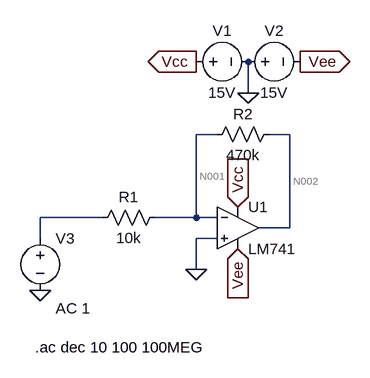
[diagram p0: schematic inverting_amp.asc]
inverting_amp.asc, the LTspice schematic file:
Version 4.1
SHEET 1 880 680
WIRE 208 -48 208 -96
WIRE 160 16 128 16
WIRE 272 16 240 16
WIRE -16 144 -112 144
WIRE 128 144 128 16
WIRE 128 144 64 144
WIRE 160 144 128 144
WIRE 272 160 272 16
WIRE 272 160 224 160
WIRE -112 176 -112 144
WIRE 160 176 128 176
WIRE 128 224 128 176
FLAG 208 -48 0
FLAG 128 -96 Vcc
IOPIN 128 -96 Out
FLAG 288 -96 Vee
IOPIN 288 -96 Out
FLAG 192 128 Vcc
IOPIN 192 128 In
FLAG 192 192 Vee
IOPIN 192 192 In
FLAG 128 224 0
FLAG -112 256 0
SYMBOL LM741 192 96 R0
SYMATTR InstName U1
SYMBOL voltage 112 -96 R270
WINDOW 0 32 56 VTop 2
WINDOW 3 -32 56 VBottom 2
WINDOW 123 0 0 Left 0
WINDOW 39 0 0 Left 0
SYMATTR InstName V1
SYMATTR Value 15V
SYMBOL voltage 192 -96 R270
WINDOW 0 32 56 VTop 2
WINDOW 3 -32 56 VBottom 2
WINDOW 123 0 0 Left 0
WINDOW 39 0 0 Left 0
SYMATTR InstName V2
SYMATTR Value 15V
SYMBOL res 80 128 R90
WINDOW 0 0 56 VBottom 2
WINDOW 3 32 56 VTop 2
SYMATTR InstName R1
SYMATTR Value 10k
SYMBOL res 256 0 R90
WINDOW 0 0 56 VBottom 2
WINDOW 3 32 56 VTop 2
SYMATTR InstName R2
SYMATTR Value 470k
SYMBOL voltage -112 160 R0
WINDOW 123 24 124 Left 2
WINDOW 39 0 0 Left 0
SYMATTR InstName V3
SYMATTR Value ""
SYMATTR Value2 AC 1
TEXT -120 344 Left 2 !.ac dec 10 100 100MEG

The netlist it stands for:
* inverting_amp.asc
X§U1 0 N001 Vcc Vee N002 LM741  ; pins In+ In- V+ V- OUT
V1 Vcc 0 15V
V2 0 Vee 15V
R1 N001 N003 10k
R2 N002 N001 470k
V3 N003 0 AC 1
.ac dec 10 100 100MEG
.lib LM741.lib
.backanno
.end

* Results of the author's LTspice run, read from the files saved beside the schematic
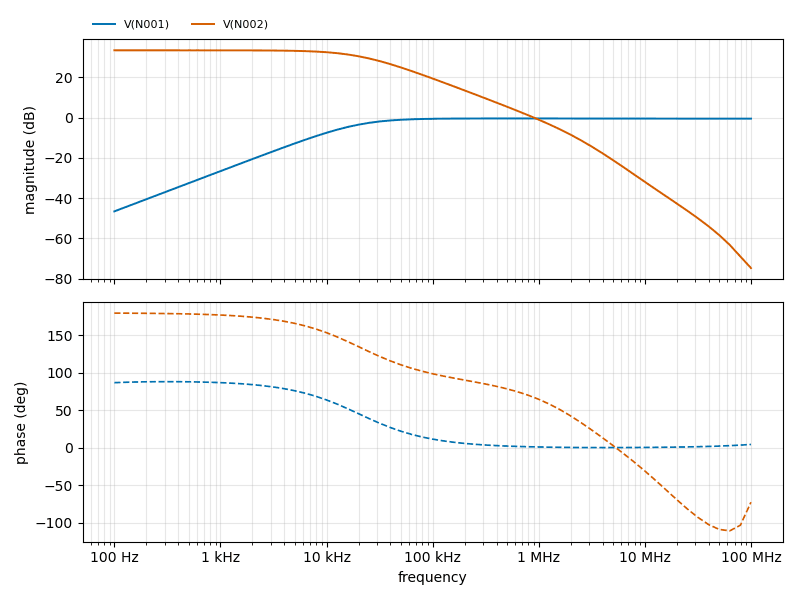
[diagram p1: AC Analysis of inverting_amp.asc, plotted from the saved traces]
* AC Analysis, 1 run:
*   V(N001): -46.55 dB at 100 Hz, -0.50 dB at 100 MHz, peak -0.40 dB at 631 kHz, 3 dB below the peak at 20.33 kHz
*   V(N002): 33.44 dB at 100 Hz, -74.72 dB at 100 MHz, peak 33.44 dB at 100 Hz, 3 dB below the peak at 20.3 kHz